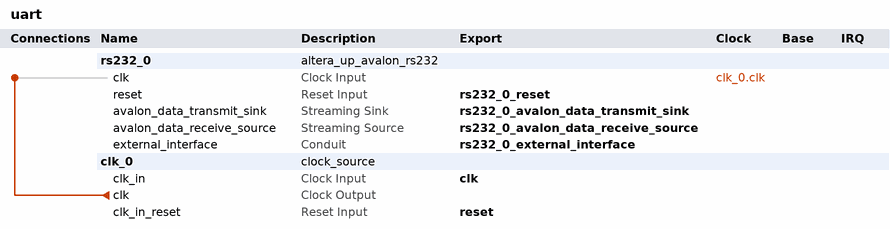
[diagram p0: system contents]
# Platform Designer (Qsys) system uart, MAX 10 10M50DAF484C7G
# Parameters at their usual value, and those the tool derives, are not listed.
package require -exact qsys 17.1
create_system uart
set_project_property DEVICE_FAMILY {MAX 10}
set_project_property DEVICE 10M50DAF484C7G

add_instance rs232_0 altera_up_avalon_rs232 17.1
set_instance_property rs232_0 AUTO_EXPORT true
set_instance_parameter_value rs232_0 avalon_bus_type Streaming
set_instance_parameter_value rs232_0 baud 115200
set_instance_parameter_value rs232_0 parity None

add_instance clk_0 clock_source 20.1
set_instance_parameter_value clk_0 clockFrequency 50000000

# connections
add_connection clk_0.clk rs232_0.clk clock

# exported interfaces
add_interface clk clock sink
set_interface_property clk EXPORT_OF clk_0.clk_in
add_interface reset reset sink
set_interface_property reset EXPORT_OF clk_0.clk_in_reset
add_interface rs232_0_avalon_data_receive_source avalon_streaming source
set_interface_property rs232_0_avalon_data_receive_source EXPORT_OF rs232_0.avalon_data_receive_source
add_interface rs232_0_avalon_data_transmit_sink avalon_streaming sink
set_interface_property rs232_0_avalon_data_transmit_sink EXPORT_OF rs232_0.avalon_data_transmit_sink
add_interface rs232_0_external_interface conduit end
set_interface_property rs232_0_external_interface EXPORT_OF rs232_0.external_interface
add_interface rs232_0_reset reset sink
set_interface_property rs232_0_reset EXPORT_OF rs232_0.reset

set_interconnect_requirement {$system} qsys_mm.clockCrossingAdapter HANDSHAKE
set_interconnect_requirement {$system} qsys_mm.enableEccProtection FALSE
set_interconnect_requirement {$system} qsys_mm.insertDefaultSlave FALSE
set_interconnect_requirement {$system} qsys_mm.maxAdditionalLatency 1

save_system uart.qsys
